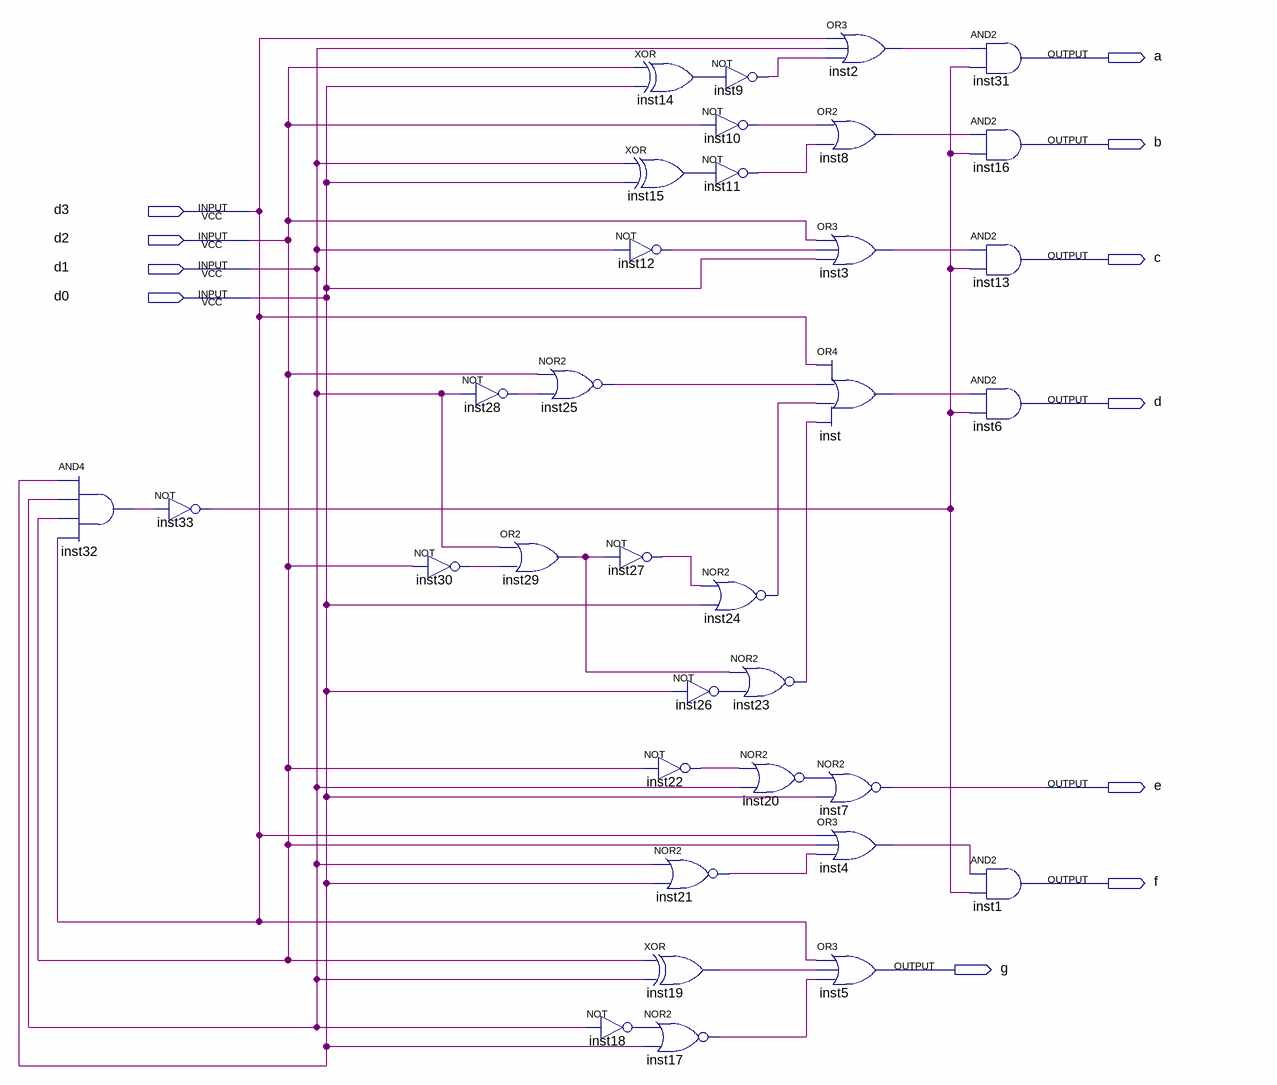
[diagram p0: schematic sheet]
// Quartus schematic BtoSeg.bdf as structural Verilog: 34 symbols, 11 pins
module BtoSeg (
  input  d3,
  input  d2,
  input  d1,
  input  d0,
  output a,
  output b,
  output c,
  output d,
  output e,
  output f,
  output g
);

  wire inst2_out, inst3_out, inst4_out, inst8_out, inst9_out, inst10_out, inst11_out, inst12_out, inst14_out,
       inst15_out, inst17_out, inst18_out, inst19_out, inst20_out, inst21_out, inst22_out, inst23_out,
       inst24_out, inst25_out, inst26_out, inst27_out, inst28_out, inst29_out, inst30_out, inst32_out,
       inst33_out, inst_out;

  and inst32 (inst32_out, d0, d1, d2, d3);
  not inst33 (inst33_out, inst32_out);
  not inst28 (inst28_out, d1);
  not inst30 (inst30_out, d2);
  nor inst25 (inst25_out, d2, inst28_out);
  or inst29 (inst29_out, d1, inst30_out);
  xor inst15 (inst15_out, d1, d0);
  not inst12 (inst12_out, d1);
  not inst27 (inst27_out, inst29_out);
  not inst18 (inst18_out, d1);
  xor inst14 (inst14_out, d2, d0);
  not inst10 (inst10_out, d2);
  not inst11 (inst11_out, inst15_out);
  nor inst24 (inst24_out, inst27_out, d0);
  not inst26 (inst26_out, d0);
  not inst22 (inst22_out, d2);
  nor inst21 (inst21_out, d1, d0);
  xor inst19 (inst19_out, d2, d1);
  nor inst17 (inst17_out, inst18_out, d0);
  not inst9 (inst9_out, inst14_out);
  nor inst23 (inst23_out, inst29_out, inst26_out);
  nor inst20 (inst20_out, inst22_out, d1);
  or inst2 (inst2_out, d3, d1, inst9_out);
  or inst8 (inst8_out, inst10_out, inst11_out);
  or inst3 (inst3_out, d2, inst12_out, d0);
  or inst (inst_out, d3, inst25_out, inst24_out, inst23_out);
  nor inst7 (e, inst20_out, d0);
  or inst4 (inst4_out, d3, d2, inst21_out);
  or inst5 (g, d3, inst19_out, inst17_out);
  and inst31 (a, inst2_out, inst33_out);
  and inst16 (b, inst8_out, inst33_out);
  and inst13 (c, inst3_out, inst33_out);
  and inst6 (d, inst_out, inst33_out);
  and inst1 (f, inst4_out, inst33_out);
endmodule
